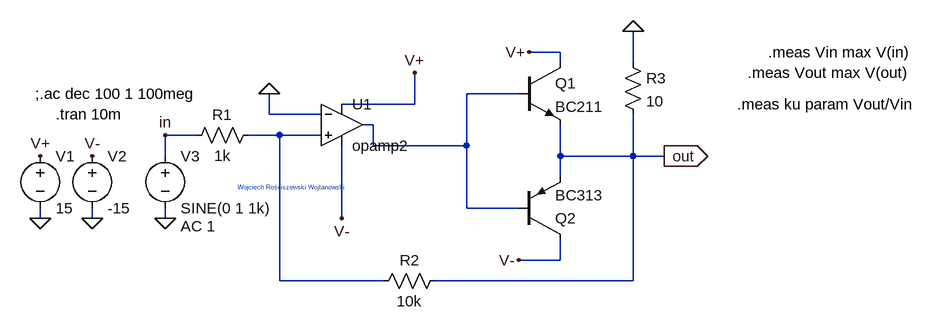
[diagram p0: schematic operational amplifier - Copy.asc]
operational amplifier - Copy.asc, the LTspice schematic file:
Version 4
SHEET 1 1260 680
WIRE 688 48 640 48
WIRE 688 64 688 48
WIRE 800 64 800 16
WIRE 624 112 544 112
WIRE 464 128 464 80
WIRE 464 128 352 128
WIRE 240 144 240 112
WIRE 320 144 240 144
WIRE 400 160 384 160
WIRE 128 176 80 176
WIRE 256 176 208 176
WIRE 320 176 256 176
WIRE 400 192 400 160
WIRE 544 192 544 112
WIRE 544 192 400 192
WIRE 80 208 80 176
WIRE 688 208 688 160
WIRE 800 208 800 144
WIRE 800 208 688 208
WIRE 848 208 800 208
WIRE 688 240 688 208
WIRE 544 288 544 192
WIRE 624 288 544 288
WIRE -112 304 -112 288
WIRE -32 304 -32 288
WIRE 80 304 80 288
WIRE 352 304 352 192
WIRE 688 368 688 336
WIRE 688 368 624 368
WIRE 256 400 256 176
WIRE 416 400 256 400
WIRE 800 400 800 208
WIRE 800 400 496 400
FLAG 80 304 0
FLAG -32 304 0
FLAG -112 304 0
FLAG -112 208 V+
FLAG -32 208 V-
FLAG 80 176 in
FLAG 240 112 0
FLAG 464 80 V+
FLAG 352 304 V-
FLAG 640 48 V+
FLAG 624 368 V-
FLAG 800 16 0
FLAG 848 208 out
IOPIN 848 208 Out
SYMBOL voltage -112 192 R0
SYMATTR InstName V1
SYMATTR Value 15
SYMBOL voltage -32 192 R0
SYMATTR InstName V2
SYMATTR Value -15
SYMBOL voltage 80 192 R0
WINDOW 123 24 124 Left 2
WINDOW 39 0 0 Left 0
SYMATTR Value2 AC 1
SYMATTR InstName V3
SYMATTR Value SINE(0 1 1k)
SYMBOL res 224 160 R90
WINDOW 0 0 56 VBottom 2
WINDOW 3 32 56 VTop 2
SYMATTR InstName R1
SYMATTR Value 1k
SYMBOL res 512 384 R90
WINDOW 0 0 56 VBottom 2
WINDOW 3 32 56 VTop 2
SYMATTR InstName R2
SYMATTR Value 10k
SYMBOL npn 624 64 R0
SYMATTR InstName Q1
SYMATTR Value BC211
SYMBOL pnp 624 336 M180
SYMATTR InstName Q2
SYMATTR Value BC313
SYMBOL res 784 48 R0
SYMATTR InstName R3
SYMATTR Value 10
SYMBOL Opamps\\opamp2 352 96 R0
SYMATTR InstName U1
SYMATTR ModelFile OPA388s.asy
TEXT -88 144 Left 2 !.tran 10m
TEXT 192 256 Left 0 ;Wojciech Rościszewski Wojtanowski
TEXT -120 112 Left 2 !;.ac dec 100 1 100meg
TEXT 1008 48 Left 2 !.meas Vin max V(in)
TEXT 976 80 Left 2 !.meas Vout max V(out)
TEXT 960 128 Left 2 !.meas ku param Vout/Vin

The netlist it stands for:
* operational amplifier - Copy.asc
V1 V+ 0 15
V2 V- 0 -15
V3 in 0 SINE(0 1 1k) AC 1
R1 N002 in 1k
R2 out N002 10k
Q1 V+ N001 out 0 BC211
Q2 V- N001 out 0 BC313
R3 0 out 10
XU1 N002 0 V+ V- N001 opamp2  ; pins In+ In- V+ V- OUT
.model NPN NPN
.model PNP PNP
.lib standard.bjt
.tran 10m
* Wojciech Rościszewski Wojtanowski
;.ac dec 100 1 100meg
.meas Vin max V(in)
.meas Vout max V(out)
.meas ku param Vout/Vin
.lib OPA388s.asy
.backanno
.end